# Altium project CLKE.PrjPcb
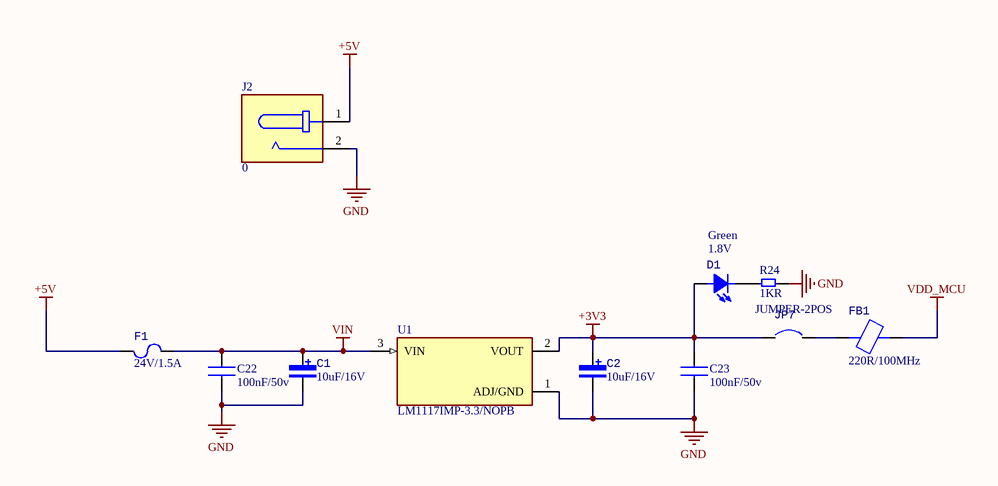
[diagram p0: POWER.SchDoc]
3 sheets, 28 parts. Net scope: flat (ports and power ports of the same name join across sheets).
Board file: PCB1.PcbDoc
Sheets:
  POWER.SchDoc
  DISPLAY.SchDoc
  RTC.SchDoc

## Sheet POWER.SchDoc
size A3; SheetNumber: 2; SheetTotal: 9

### Parts
C1  10uF/16V  [CAP_Tantalum_3216]
C2  10uF/16V  [CAP_Tantalum_3216]
C22  100nF/50v  [CAP-CER-0805]
C23  100nF/50v  [CAP-CER-0805]
D1  Mfr# #: Green  [LED_SMD_0805_GREEN]  (hidden comment: 1.8V)
F1  24V/1.5A  [FUSER_MF-MSMF150/24X-2]
FB1  220R/100MHz  [FERRITE-0603]
J2  0  [CUI_PJ-037AH]
JP7  JUMPER-2POS  [JUMPER-2POS-2.54]
R24  1KR  [RES-SMD-0805]
U1  LM1117IMP-3.3/NOPB  [LM1117IMP-3.3/NOPB]

### Nets
+3V3: C2.1 C23.2 D1.1(A) JP7.1 U1.2(VOUT)
+5V: F1.2 J2.1
GND: C1.2 C2.2 C22.1 C23.1 J2.2 R24.2 U1.1(ADJ/GND)
VDD_MCU: FB1.2
VIN: C1.1 C22.2 F1.1 U1.3(VIN)
NetD1_2: D1.2(K) R24.1
NetFB1_1: FB1.1 JP7.2

### Library data of the parts
C1 C2 = ID-25: Tụ Tantalum 10uF 16V 1206 TAJA106K016RNJ; Design Item ID: ID-25; Value: 10uF/16V
C22 C23 = CAP-CER
D1 = ID-26: LED Xanh Lá 0805 Dán SMD Trong Suốt Harvatek; Design Item ID: ID-26; Value: 1.8V
F1 = ID-29: MF-MSMF150/24X-2 Cầu Chì Tự Phục Hồi 1812 24V 1.5A; Design Item ID: ID-29; Value: 24V/1.5A
FB1 = ID-27: Design Item ID: ID-27; Value: 220R/100MHz
J2 = JACK DC: 2.0 x 6.5 mm, 5.0 A, Horizontal, Through Hole, Dc Power Jack Connector; MF: Same Sky; MP: PJ-037AH; SnapEDA_Link: https://www.snapeda.com/parts/PJ-037AH/Same+Sky/view-part/?ref=snap; Package: None; Value: *; Check_prices: https://www.snapeda.com/parts/PJ-037AH/Same+Sky/view-part/?ref=eda
JP7 = ID-7: Design Item ID: ID-7; Mfr# #: JUMPER-2POS
R24 = RES_SMD
U1 = LDO: 800-mA 15-V linear voltage regulator; MF: Texas Instruments; SnapEDA_Link: https://www.snapeda.com/parts/LM1117IMP-3.3/NOPB/Texas+Instruments/view-part/?ref=snap; Package: SOT-223-4 Texas Instruments; Value: *; MP: LM1117IMP-3.3/NOPB; Check_prices: https://www.snapeda.com/parts/LM1117IMP-3.3/NOPB/Texas+Instruments/view-part/?ref=eda

## Sheet DISPLAY.SchDoc
size A3; SheetNumber: 3; SheetTotal: 8
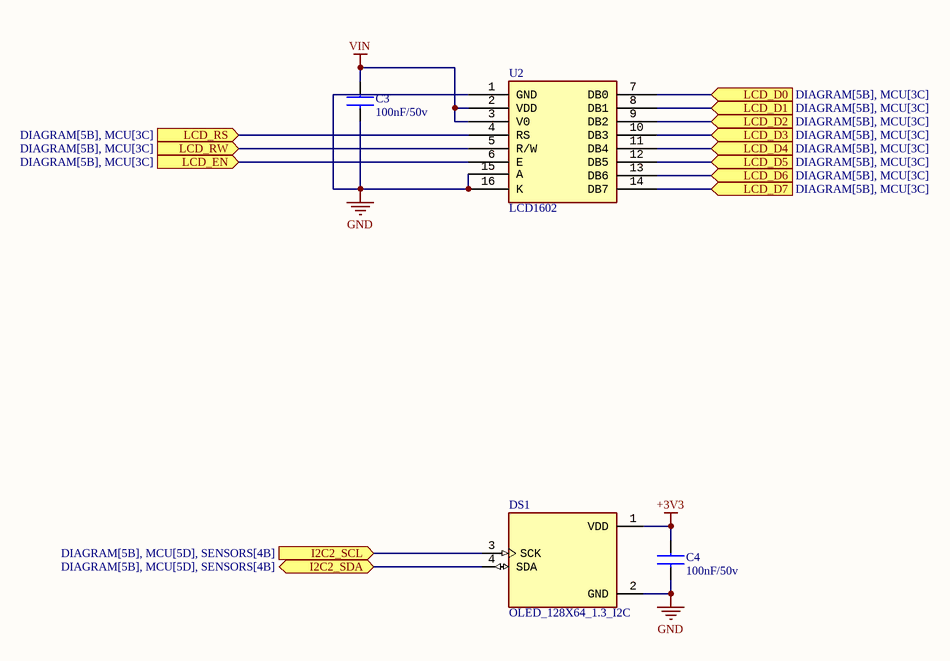
[diagram p1: DISPLAY.SchDoc]

### Parts
C3  100nF/50v  [CAP-CER-0805]
C4  100nF/50v  [CAP-CER-0805]
DS1  OLED_128X64_1.3_I2C  [LCD_OLED_128X64_1.3_I2C]
U2  LCD1602  [LCD16X2]

### Ports
I2C2_SCL (in, see DIAGRAM[5B], MCU[5D], SENSORS[4B]), I2C2_SDA (bidir, see DIAGRAM[5B], MCU[5D], SENSORS[4B]), LCD_D0 (in, see DIAGRAM[5B], MCU[3C]), LCD_D1 (in, see DIAGRAM[5B], MCU[3C]), LCD_D2 (in, see DIAGRAM[5B], MCU[3C]), LCD_D3 (in, see DIAGRAM[5B], MCU[3C]), LCD_D4 (in, see DIAGRAM[5B], MCU[3C]), LCD_D5 (in, see DIAGRAM[5B], MCU[3C]), LCD_D6 (in, see DIAGRAM[5B], MCU[3C]), LCD_D7 (in, see DIAGRAM[5B], MCU[3C]), LCD_EN (in, see DIAGRAM[5B], MCU[3C]), LCD_RS (in, see DIAGRAM[5B], MCU[3C]), LCD_RW (in, see DIAGRAM[5B], MCU[3C])

### Nets
+3V3: C4.2 DS1.1(VDD)
GND: C3.1 C4.1 DS1.2(GND) U2.1(GND) U2.15(A) U2.16(K)
VIN: C3.2 U2.2(VDD) U2.3(V0)
NetDS1_3: DS1.3(SCK) ; port I2C2_SCL
NetDS1_4: DS1.4(SDA) ; port I2C2_SDA
NetU2_4: U2.4(RS) ; port LCD_RS
NetU2_5: U2.5(R/W) ; port LCD_RW
NetU2_6: U2.6(E) ; port LCD_EN
NetU2_7: U2.7(DB0) ; port LCD_D0
NetU2_8: U2.8(DB1) ; port LCD_D1
NetU2_9: U2.9(DB2) ; port LCD_D2
NetU2_10: U2.10(DB3) ; port LCD_D3
NetU2_11: U2.11(DB4) ; port LCD_D4
NetU2_12: U2.12(DB5) ; port LCD_D5
NetU2_13: U2.13(DB6) ; port LCD_D6
NetU2_14: U2.14(DB7) ; port LCD_D7

### Library data of the parts
C3 C4 = CAP-CER
DS1 = ID-5: MF: UNIVERSAL-SOLDER Electronics Ltd; MP: OLED 128x64 1.3&quot; I2C; SnapEDA_Link: https://www.snapeda.com/parts/OLED%20128x64%201.3%22%20I2C/UNIVERSAL-SOLDER+Electronics+Ltd/view-part/?ref=snap; Package: None; Value: *; Check_prices: https://www.snapeda.com/parts/OLED%20128x64%201.3%22%20I2C/UNIVERSAL-SOLDER+Electronics+Ltd/view-part/?ref=eda; Design Item ID: ID-5; Mfr# #: OLED_128X64_1.3_I2C

## Sheet RTC.SchDoc
size A3; SheetNumber: 4; SheetTotal: 8
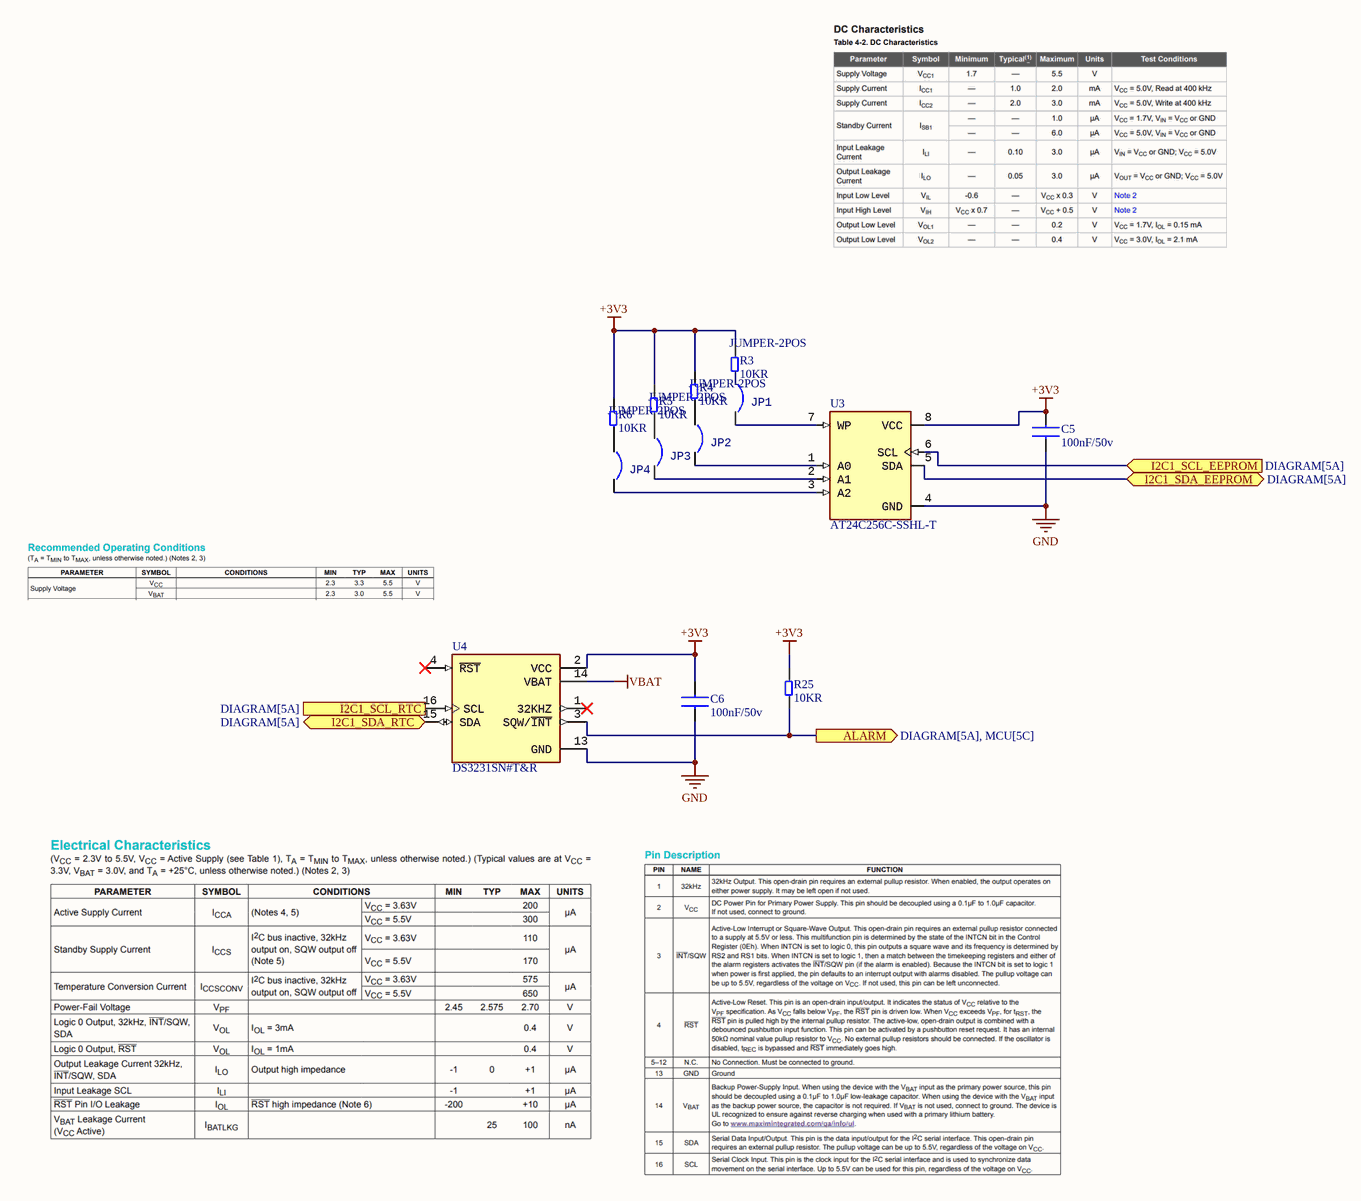
[diagram p2: RTC.SchDoc]

### Parts
C5  100nF/50v  [CAP-CER-0805]
C6  100nF/50v  [CAP-CER-0805]
JP1  JUMPER-2POS  [JUMPER-2POS-2.54]
JP2  JUMPER-2POS  [JUMPER-2POS-2.54]
JP3  JUMPER-2POS  [JUMPER-2POS-2.54]
JP4  JUMPER-2POS  [JUMPER-2POS-2.54]
R3  10KR  [RES-SMD-0805]
R4  10KR  [RES-SMD-0805]
R5  10KR  [RES-SMD-0805]
R6  10KR  [RES-SMD-0805]
R25  10KR  [RES-SMD-0805]
U3  AT24C256C-SSHL-T  [AT24C256C-SSHL-T]
U4  DS3231SN#T&R  [DS3231SN_SOIC127P1032X265-16N]

### Ports
ALARM (out, see DIAGRAM[5A], MCU[5C]), I2C1_SCL_EEPROM (in, see DIAGRAM[5A]), I2C1_SCL_RTC (in, see DIAGRAM[5A]), I2C1_SDA_EEPROM (bidir, see DIAGRAM[5A]), I2C1_SDA_RTC (bidir, see DIAGRAM[5A])

### Nets
+3V3: C5.2 C6.2 R3.2 R4.2 R5.2 R6.2 R25.2 U3.8(VCC) U4.2(VCC)
GND: C5.1 C6.1 U3.4(GND) U4.13(GND)
VBAT: U4.14(VBAT)
NetJP1_1: JP1.1 R3.1
NetJP1_2: JP1.2 U3.7(WP)
NetJP2_1: JP2.1 R4.1
NetJP2_2: JP2.2 U3.1(A0)
NetJP3_1: JP3.1 R5.1
NetJP3_2: JP3.2 U3.2(A1)
NetJP4_1: JP4.1 R6.1
NetJP4_2: JP4.2 U3.3(A2)
NetR25_1: R25.1 U4.3(SQW/~{INT}) ; port ALARM
NetU3_5: U3.5(SDA) ; port I2C1_SDA_EEPROM
NetU3_6: U3.6(SCL) ; port I2C1_SCL_EEPROM
NetU4_15: U4.15(SDA) ; port I2C1_SDA_RTC
NetU4_16: U4.16(SCL) ; port I2C1_SCL_RTC

Not connected (* = marked no-connect by the designer): U4 1(32KHZ)* 4(~{RST})*

### Library data of the parts
C5 C6 = CAP-CER
JP1-JP4 = ID-7: Design Item ID: ID-7; Mfr# #: JUMPER-2POS
R3-R6 R25 = RES_SMD
U3 = ID-9: EEPROM Memory IC 256Kbit I2C 1 MHz 550 ns 8-SOIC; Design Item ID: ID-9; Mfr# #: AT24C256C-SSHL-T
U4 = ID-8: Real Time Clock (RTC) IC Clock/Calendar I2C, 2-Wire Serial 16-SOIC (0.295", 7.50mm Width); Design Item ID: ID-8; Mfr# #: DS3231SN#T&R

## Nets that join several sheets
+3V3: POWER (5 pins), DISPLAY (C4.2 DS1.1), RTC (9 pins)
GND: POWER (7 pins), DISPLAY (6 pins), RTC (C5.1 C6.1 U3.4 U4.13)
VIN: POWER (C1.1 C22.2 F1.1 U1.3), DISPLAY (C3.2 U2.2 U2.3)